# Altium schematic sheet Battery_Management.SchDoc: Battery Management
size A3; SheetNumber: 4; SheetTotal: 6
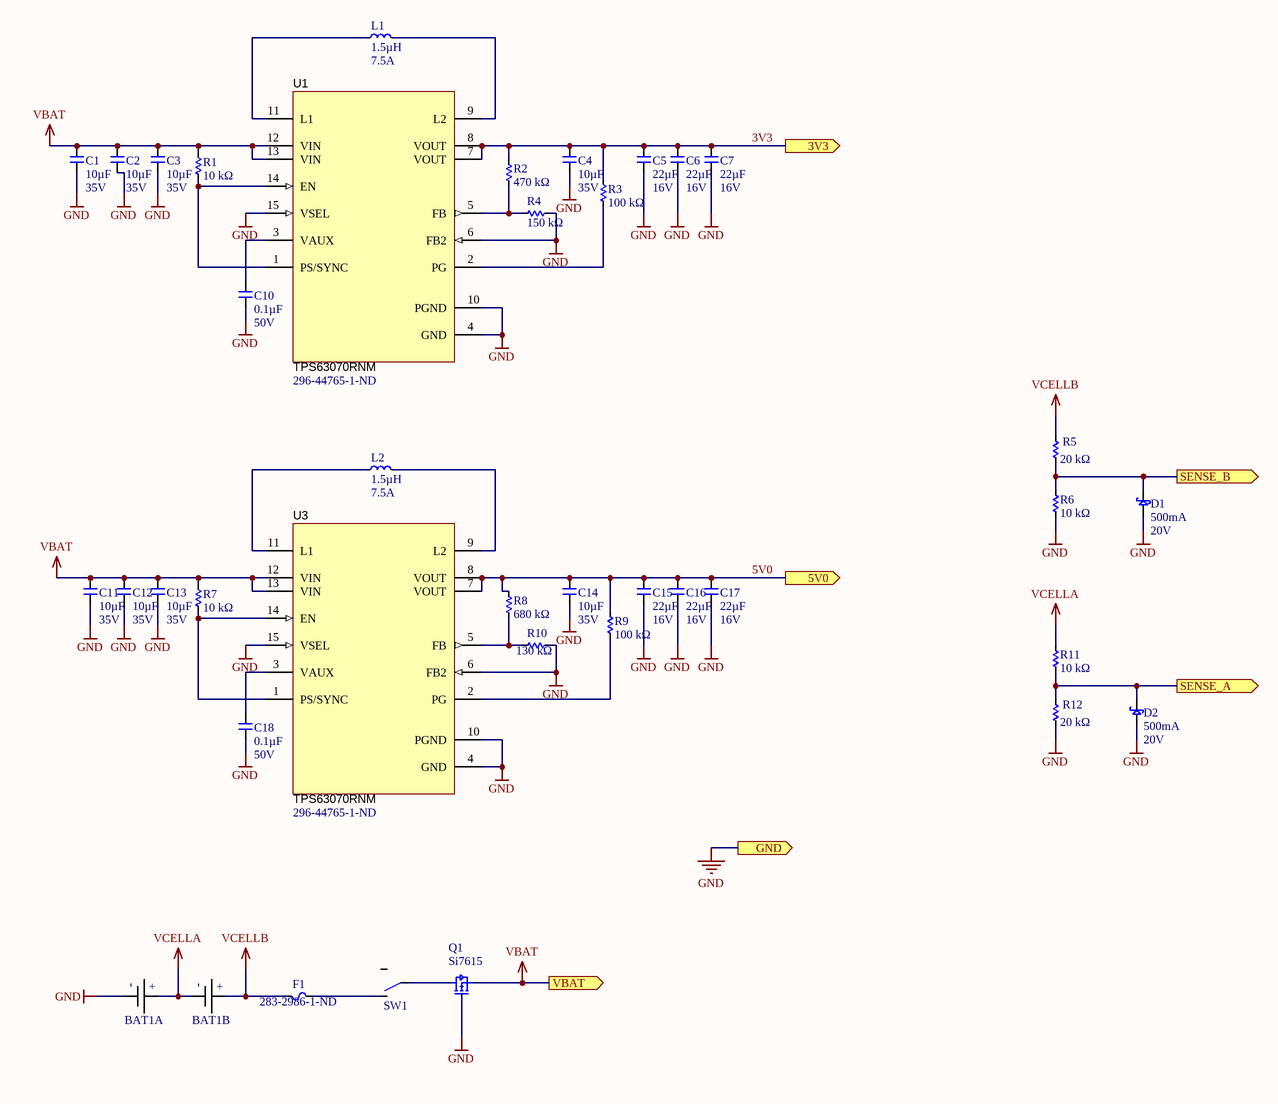
[diagram p0: Battery_Management.SchDoc]

## Parts
BAT1  BATT_Clip_Li-Ion_2x  [BATT_18650_KEYSTONE_1048]  (value not drawn)  (parts A,B of 2)
C1  Capacitance (shorthand): 10µF  Rated Voltage: 35V  [C0603]  (hidden comment: __template_cap)
C2  Capacitance (shorthand): 10µF  Rated Voltage: 35V  [C0603]  (hidden comment: __template_cap)
C3  Capacitance (shorthand): 10µF  Rated Voltage: 35V  [C0603]  (hidden comment: __template_cap)
C4  Capacitance (shorthand): 10µF  Rated Voltage: 35V  [C0603]  (hidden comment: __template_cap)
C5  Capacitance (shorthand): 22µF  Rated Voltage: 16V  [C0603]  (hidden comment: __template_cap)
C6  Capacitance (shorthand): 22µF  Rated Voltage: 16V  [C0603]  (hidden comment: __template_cap)
C7  Capacitance (shorthand): 22µF  Rated Voltage: 16V  [C0603]  (hidden comment: __template_cap)
C10  Capacitance (shorthand): 0.1µF  Rated Voltage: 50V  [C0603]  (hidden comment: __template_cap)
C11  Capacitance (shorthand): 10µF  Rated Voltage: 35V  [C0603]  (hidden comment: __template_cap)
C12  Capacitance (shorthand): 10µF  Rated Voltage: 35V  [C0603]  (hidden comment: __template_cap)
C13  Capacitance (shorthand): 10µF  Rated Voltage: 35V  [C0603]  (hidden comment: __template_cap)
C14  Capacitance (shorthand): 10µF  Rated Voltage: 35V  [C0603]  (hidden comment: __template_cap)
C15  Capacitance (shorthand): 22µF  Rated Voltage: 16V  [C0603]  (hidden comment: __template_cap)
C16  Capacitance (shorthand): 22µF  Rated Voltage: 16V  [C0603]  (hidden comment: __template_cap)
C17  Capacitance (shorthand): 22µF  Rated Voltage: 16V  [C0603]  (hidden comment: __template_cap)
C18  Capacitance (shorthand): 0.1µF  Rated Voltage: 50V  [C0603]  (hidden comment: __template_cap)
D1  Current - Average Rectified (Io): 500mA  Voltage - DC Reverse (Vr) (Max): 20V  [SOD123]  (hidden comment: SCHOTTKY_MBR0520L)
D2  Current - Average Rectified (Io): 500mA  Voltage - DC Reverse (Vr) (Max): 20V  [SOD123]  (hidden comment: SCHOTTKY_MBR0520L)
F1  Supplier Part Number 1: 283-2986-1-ND  [R1206]  (hidden comment: __template_fuse)
L1  Inductance: 1.5µH  Current Rating: 7.5A  [SMD5230]  (hidden comment: IND_IHLP2020CZER1R5M11)
L2  Inductance: 1.5µH  Current Rating: 7.5A  [SMD5230]  (hidden comment: IND_IHLP2020CZER1R5M11)
Q1  Si7615  [POWERPAK_1212-8_SINGLE]
R1  Resistance: 10 kΩ  [R0603]  (hidden comment: __template_resistor)
R2  Resistance: 470 kΩ  [R0603]  (hidden comment: RC0603FR-07470KL)
R3  Resistance: 100 kΩ  [R0603]  (hidden comment: RC0603FR-07100KL)
R4  Resistance: 150 kΩ  [R0603]  (hidden comment: RC0603FR-07150KL)
R5  Resistance: 20 kΩ  [R0603]  (hidden comment: __template_resistor)
R6  Resistance: 10 kΩ  [R0603]  (hidden comment: __template_resistor)
R7  Resistance: 10 kΩ  [R0603]  (hidden comment: __template_resistor)
R8  Resistance: 680 kΩ  [R0603]  (hidden comment: RC0603FR-07680KL)
R9  Resistance: 100 kΩ  [R0603]  (hidden comment: RC0603FR-07100KL)
R10  Resistance: 130 kΩ  [R0603]  (hidden comment: RC0603FR-07130KL)
R11  Resistance: 10 kΩ  [R0603]  (hidden comment: __template_resistor)
R12  Resistance: 20 kΩ  [R0603]  (hidden comment: __template_resistor)
SW1  (no value)  [SWITCH_500SSP1S1M6QEA]
U1  TPS63070RNM  Supplier Part Number 1: 296-44765-1-ND  [TPS63070]
U3  TPS63070RNM  Supplier Part Number 1: 296-44765-1-ND  [TPS63070]

## Ports
3V3 (out), 5V0 (out), GND (out), SENSE_A (out), SENSE_B (out), VBAT (out)

## Nets
GND: BAT1.CELL1- C1.2 C2.2 C3.2 C4.2 C5.2 C6.2 C7.2 C10.2 C11.2 C12.2 C13.2 C14.2 C15.2 C16.2 C17.2 C18.2 D1.1 D2.1 Q1.1 R4.2 R6.1 R10.2 R12.1 U1.4(GND) U1.6(FB2) U1.10(PGND) U1.15(VSEL) U3.4(GND) U3.6(FB2) U3.10(PGND) U3.15(VSEL) ; port GND
VBAT: C1.1 C2.1 C3.1 C11.1 C12.1 C13.1 Q1.2 R1.2 R7.2 U1.12(VIN) U1.13(VIN) U3.12(VIN) U3.13(VIN) ; port VBAT
VCELLA: BAT1.CELL1+ BAT1.CELL2- R11.2
VCELLB: BAT1.CELL2+ F1.1 R5.2
3V3: C4.1 C5.1 C6.1 C7.1 R2.2 R3.2 U1.7(VOUT) U1.8(VOUT) ; port 3V3
5V0: C14.1 C15.1 C16.1 C17.1 R8.2 R9.2 U3.7(VOUT) U3.8(VOUT) ; port 5V0
SENSE_A: D2.2 R11.1 R12.2 ; port SENSE_A
SENSE_B: D1.2 R5.1 R6.2 ; port SENSE_B
NetC10_1: C10.1 U1.3(VAUX)
NetC18_1: C18.1 U3.3(VAUX)
NetF1_2: F1.2 SW1.3
NetL1_1: L1.1 U1.11(L1)
NetL1_2: L1.2 U1.9(L2)
NetL2_1: L2.1 U3.11(L1)
NetL2_2: L2.2 U3.9(L2)
NetQ1_3: Q1.3 SW1.2
NetR1_1: R1.1 U1.1(PS/SYNC) U1.14(EN)
NetR2_1: R2.1 R4.1 U1.5(FB)
NetR3_1: R3.1 U1.2(PG)
NetR7_1: R7.1 U3.1(PS/SYNC) U3.14(EN)
NetR8_1: R8.1 R10.1 U3.5(FB)
NetR9_1: R9.1 U3.2(PG)

Not connected (* = marked no-connect by the designer): SW1 1

## Notes on the sheet
- Title
- Size:
- Date:
- A3
- Number:
- Time:
- Revision:
- Sheet
- of
- File:
- (in symbol BATT_Clip_Li-Ion_2x, part A) +
- (in symbol BATT_Clip_Li-Ion_2x, part B) +

## Library data of the parts
BAT1 = BATT_Clip_Li-Ion_2x: Dual Lithium Ion Cell Holder; Manufacturer: Keystone Electronics; Manufacturer Part Number: 1048P; Battery Type, Function: Cylindrical, Holder; Style: Holder (Open); Battery Cell Size: 18650; Number of Cells: 2; Supplier 1: Digi-Key; RoHS: RoHS Compliant; Category: Battery Products; Stock 1: 759; Pricing 1: 1=4.81, 10=4.007, 50=3.506, 100=3.339, 250=2.92164, 500=2.83816, 1000=2.42078, 2500=2.25382, 5000=2.24047 (USD); Battery Series: -; Mounting Type: PCB, Surface Mount; Termination Style: SMD (SMT) Tab; Height Above Board: 0.585" (14.86mm); Operating Temperature: -50°C ~ 145°C; ComponentLink1URL: http://www.keyelco.com/product-pdf.cfm?p=13959; ComponentLink1Description: http://www.keyelco.com/product-pdf.cfm?p=13959; Supplier 2: Digi-Key
C1-C4 C11-C14 = CAP CER 10UF 35V X5R 0603 20%: Manufacturer: Murata Electronics North America; Capacitance - pF (Machine readable): 10000000; type: capacitor; Dielectric: X5R; Supplier 1: Digikey; Supplier Part Number 1: 490-13248-1-ND
C5-C7 C15-C17 = CAP CER 22UF 16V X5R 0603 20%: Manufacturer: Samsung Electro-Mechanics; Capacitance - pF (Machine readable): 22000000; type: capacitor; Dielectric: X5R; Supplier 1: Digikey; Supplier Part Number 1: 1276-7076-1-ND
C10 C18 = CAP CER 0603 0.1µF X7R 50V 10%: Manufacturer: Murata Electronics North America; Capacitance - pF (Machine readable): 100000; type: capacitor; Dielectric: X7R; Supplier 1: Digikey; Supplier Part Number 1: 490-1519-1-ND
D1 D2 = SCHOTTKY_MBR0520L: DIODE SCHOTTKY 0.5A 20V SOD-123; Manufacturer: Fairchild Semiconductor; Speed: Fast Recovery =< 500ns, > 200mA (Io); Current - Reverse Leakage @ Vr: 250µA @ 20V; Voltage - Forward (Vf) (Max) @ If: 385mV @ 500mA; Supplier 1: Digi-Key; Manufacturer Part Number: MBR0520L; RoHS: RoHS Compliant; Category: Discrete Semiconductor Products; Stock 1: 217232; Pricing 1: 1=0.63, 10=0.43, 100=0.2024, 250=0.1442, 500=0.11006, 750=0.08603, 1000=0.0759 (USD); Diode Type: Schottky; Reverse Recovery Time (trr): -; Capacitance @ Vr, F: -; Mounting Type: Surface Mount; Package / Case: SOD-123; Supplier Device Package: SOD-123; Packaging: Cut Tape (CT); ComponentLink1URL: http://www.fairchildsemi.com/ds/MB/MBR0520L.pdf; ComponentLink1Description: Datasheet; Supplier Part Number 1: MBR0520LCT-ND
F1 = __template_fuse: Manufacturer: Eaton; Manufacturer Part Number: CC12H5A-TR; Fuse Type: Board Mount (Cartridge Style Excluded); Current Rating: 5A; Voltage Rating - DC: 32V; Response Time: Slow; Breaking Capacity @ Rated Voltage: 100A; Melting I²t: 6; Approvals: cURus; DC Cold Resistance: 0.021 Ohm; Supplier 1: Digi-Key; RoHS: RoHS Compliant; Category: Circuit Protection; Stock 1: 9201; Pricing 1: 1=0.99, 5=0.954, 10=0.893, 50=0.7392, 100=0.616, 250=0.6006, 500=0.5082, 1000=0.4466 (USD); Packaging: Cut Tape (CT); Part Status: Active; Voltage Rating - AC: -; Package / Case: 1206 (3216 Metric); Mounting Type: Surface Mount; Operating Temperature: -55°C ~ 125°C; Color: -; Size / Dimension: 0.126" L x 0.063" W x 0.024" H (3.20mm x 1.60mm x 0.60mm); ComponentLink1URL: http://www.cooperindustries.com/content/dam/public/bussmann/Electronics/Resources/product-datasheets/Bus_Elx_DS_4309_CC12H_Series.pdf; ComponentLink1Description: http://www.cooperindustries.com/content/dam/public/bussmann/Electronics/Resources/product-datasheets/Bus_Elx_DS_4309_CC12H_Series.pdf
L1 L2 = IND_IHLP2020CZER1R5M11: INDUCTOR POWER 1.5UH 7.5A SMD; Manufacturer: Vishay Dale; Current - Saturation: 7A; Tolerance: ±20%; Shielding: Shielded; DC Resistance (DCR): 18.5 mOhm Max; Frequency - Test: 100kHz; Supplier 1: Digi-Key; Manufacturer Part Number: IHLP2020CZER1R5M11; RoHS: RoHS Compliant; Category: Inductors, Coils, Chokes; Stock 1: 17936; Pricing 1: 1=2.29, 10=1.86, 100=1.55, 500=1.24, 1000=1.116 (USD); Type: -; Material - Core: -; Q @ Freq: -; Frequency - Self Resonant: -; Operating Temperature: -55°C ~ 125°C; Package / Case: Non Standard; Size / Dimension: 0.216" L x 0.204" W x 0.118" H (5.49mm x 5.18mm x 3.00mm); Mounting Type: Surface Mount; Packaging: Cut Tape (CT); ComponentLink1URL: http://www.vishay.com/docs/34260/lp20cz11.pdf; ComponentLink1Description: Datasheet; Supplier Part Number 1: 541-1235-1-ND
Q1 = PFET_SI7615ADN-T1: MOSFET P-CH 20V 35A PPK; pin to pad: 1>4 2>1 3>5; Manufacturer: Vishay Siliconix; Manufacturer Part Number: SI7615ADN-T1-GE3; FET Type: MOSFET P-Channel, Metal Oxide; FET Feature: Standard; Current - Continuous Drain (Id) @ 25°C: 35A (Tc); Rds On (Max) @ Id, Vgs: 4.4 mOhm @ 20A, 10V; Vgs(th) (Max) @ Id: 1.5V @ 250µA; Gate Charge (Qg) @ Vgs: 183nC @ 10V; Input Capacitance (Ciss) @ Vds: 5590pF @ 10V; Power - Max: 52W; Supplier 1: Digi-Key; Supplier Part Number 1: SI7615ADN-T1-GE3CT-ND; RoHS: RoHS Compliant; Category: Discrete Semiconductor Products; Stock 1: 99744; Pricing 1: 1=0.73, 10=0.646, 25=0.6068, 100=0.4951, 250=0.45988, 500=0.3914, 1000=0.31312 (USD); Packaging: Cut Tape (CT); Part Status: Active; Drain to Source Voltage (Vdss): 20V; Operating Temperature: -55°C ~ 150°C (TJ); Mounting Type: Surface Mount; Package / Case: PowerPAK® 1212-8; Supplier Device Package: PowerPAK® 1212-8; ComponentLink1URL: http://www.vishay.com/docs/62667/si7615adn.pdf; ComponentLink1Description: http://www.vishay.com/docs/62667/si7615adn.pdf
R1 R6 R7 R11 = RES SMD 10K OHM 1% 1/10W 0603: Manufacturer Part Number: RC0603FR-0710KL; Manufacturer: Yageo; Resistance (Sortable): 10000; Tolerance: ±1%; Power (Watts): 0.1W, 1/10W; Temperature Coefficient: ±100ppm/°C; Supplier 1: Digikey; Datasheets: http://www.yageo.com/documents/recent/PYu-RC_Group_51_RoHS_L_9.pdf; Image: //media.digikey.com/Renders/Yageo%20Renders/0603-(1608-Metric).jpg; Supplier Part Number 1: 311-10.0KHRCT-ND; Operating Temperature: -55°C ~ 155°C
R2 = RES SMD 470K OHM 1% 1/10W 0603: Manufacturer: Yageo; Tolerance: ±1%; Power (Watts): 0.1W, 1/10W; Resistance (Sortable): 470000; Temperature Coefficient: ±100ppm/°C; Manufacturer Part Number: RC0603FR-07470KL; Supplier 1: Digikey; Datasheets: http://www.yageo.com/documents/recent/PYu-RC_Group_51_RoHS_L_9.pdf; Image: //media.digikey.com/Renders/Yageo%20Renders/0603-(1608-Metric).jpg; Supplier Part Number 1: 311-470KHRCT-ND; Operating Temperature: -55°C ~ 155°C
R3 R9 = RES SMD 100K OHM 1% 1/10W 0603: Manufacturer: Yageo; Tolerance: ±1%; Power (Watts): 0.1W, 1/10W; Resistance (Sortable): 100000; Temperature Coefficient: ±100ppm/°C; Manufacturer Part Number: RC0603FR-07100KL; Supplier 1: Digikey; Datasheets: http://www.yageo.com/documents/recent/PYu-RC_Group_51_RoHS_L_9.pdf; Image: //media.digikey.com/Renders/Yageo%20Renders/0603-(1608-Metric).jpg; Supplier Part Number 1: 311-100KHRCT-ND; Operating Temperature: -55°C ~ 155°C
R4 = RES SMD 150K OHM 1% 1/10W 0603: Manufacturer: Yageo; Tolerance: ±1%; Power (Watts): 0.1W, 1/10W; Resistance (Sortable): 150000; Temperature Coefficient: ±100ppm/°C; Manufacturer Part Number: RC0603FR-07150KL; Supplier 1: Digikey; Datasheets: http://www.yageo.com/documents/recent/PYu-RC_Group_51_RoHS_L_9.pdf; Image: //media.digikey.com/Renders/Yageo%20Renders/0603-(1608-Metric).jpg; Supplier Part Number 1: 311-150KHRCT-ND; Operating Temperature: -55°C ~ 155°C
R5 R12 = RES SMD 20K OHM 1% 1/10W 0603: Manufacturer Part Number: RC0603FR-0720KL; Manufacturer: Yageo; Resistance (Sortable): 20000; Tolerance: ±1%; Power (Watts): 0.1W, 1/10W; Temperature Coefficient: ±100ppm/°C; Supplier 1: Digikey; Datasheets: http://www.yageo.com/documents/recent/PYu-RC_Group_51_RoHS_L_9.pdf; Image: //media.digikey.com/Renders/Yageo%20Renders/0603-(1608-Metric).jpg; Supplier Part Number 1: 311-20.0KHRCT-ND; Operating Temperature: -55°C ~ 155°C
R8 = RES SMD 680K OHM 1% 1/10W 0603: Manufacturer: Yageo; Tolerance: ±1%; Power (Watts): 0.1W, 1/10W; Resistance (Sortable): 680000; Temperature Coefficient: ±100ppm/°C; Manufacturer Part Number: RC0603FR-07680KL; Supplier 1: Digikey; Datasheets: http://www.yageo.com/documents/recent/PYu-RC_Group_51_RoHS_L_9.pdf; Image: //media.digikey.com/Renders/Yageo%20Renders/0603-(1608-Metric).jpg; Supplier Part Number 1: 311-680KHRCT-ND; Operating Temperature: -55°C ~ 155°C
R10 = RES SMD 130K OHM 1% 1/10W 0603: Manufacturer: Yageo; Tolerance: ±1%; Power (Watts): 0.1W, 1/10W; Resistance (Sortable): 130000; Temperature Coefficient: ±100ppm/°C; Manufacturer Part Number: RC0603FR-07130KL; Supplier 1: Digikey; Datasheets: http://www.yageo.com/documents/recent/PYu-RC_Group_51_RoHS_L_9.pdf; Image: //media.digikey.com/Renders/Yageo%20Renders/0603-(1608-Metric).jpg; Supplier Part Number 1: 311-130KHRCT-ND; Operating Temperature: -55°C ~ 155°C
SW1 = SWITCH_500SSP1S1M6QEA: SWITCH SLIDE SPDT R/A 5A; Manufacturer: E-Switch; Contact Timing: Not Specified; Switch Function: On-On; Current Rating: 5A (AC/DC); Voltage Rating - AC: 120V; Voltage Rating - DC: 28V; Actuator Type: Standard; Actuator Length: 4.72mm; Actuator Material: Polyamide (PA), Nylon; Switch Travel: 2.16mm; Mechanical Life: 30,000 Cycles; Supplier 1: Digi-Key; Manufacturer Part Number: 500SSP1S1M6QEA; RoHS: RoHS Compliant; Category: Switches; Stock 1: 8402; Pricing 1: 1=2.93, 10=2.808, 25=2.7484, 50=2.39, 100=2.3303, 250=2.27052, 500=1.912, 1000=1.7925, 5000=1.64313 (USD); Packaging: Bulk; Part Status: Active; Circuit: SPDT; Contact Material: Copper Alloy; Contact Finish: Silver; Mounting Type: Through Hole, Right Angle; Termination Style: PC Pin; Features: Epoxy Sealed Terminals; Operating Temperature: -30°C ~ 85°C; Electrical Life: 30,000 Cycles; Operating Force: -; ComponentLink1URL: http://spec_sheets.e-switch.com/specs/T511006.pdf; ComponentLink1Description: http://spec_sheets.e-switch.com/specs/T511006.pdf; Supplier Part Number 1: EG2478-ND
U1 U3 = TPS63070RNM: BUCKBOOST TPS63070RNM, RNM0015A; Manufacturer: Texas Instruments; SymbolCreator: Altium; SizeX_mm: 2.5; SizeY_mm: 3; SizeZ_mm: 1; CompType: IC; U/M: EA; SymbolVersion: 2015-05-01; PartNumber: TPS63070RNM; PackageReference: RNM0015A; PackageDescription: VQFN-HR-15; MountType: SMT; ComponentLink1Description: Datasheet Link; ComponentLink1URL: https://sps06.itg.ti.com/sites/KMS/crossdivteams/altium/docs/ComponentDatasheets/TPS63070_datasheet_23_April2015.pdf; Publisher: Texas Instruments; LatestRevisionDate: 2016-05-12; Alternate Manufacturer: Texas Instruments; Supplier 1: Digi-Key